# EAGLE design stlink-to-bc (EAGLE 8.0.1)
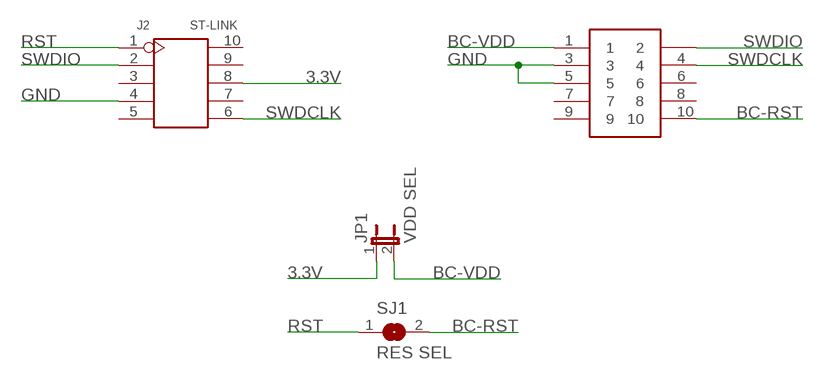
[diagram p0: schematic, sheet 1]

## Parts
J1  BC  SHF105  [SHF105DSM_1]
J2  ST-LINK  DIP-BLACK-FEMALE-HEADER(2X5P-2.54)V2X5-2.54  [V2X5-2.54]
JP1  VDD SEL  JP1E  [JP1]
SJ1  RES SEL  SJ  [SJ]

## Nets
3.3V: J2.8 JP1.1
BC-RST: J1.10 SJ1.2
BC-VDD: J1.1 JP1.2
GND: J1.3 J1.5 J2.4
RST: J2.1 SJ1.1
SWDCLK: J1.4 J2.6
SWDIO: J1.2 J2.2
Unconnected: J1.6 J1.7 J1.8 J1.9 J2.3 J2.5 J2.7 J2.9 J2.10

## Library data of the parts
J1 = Gadgeteer:SHF105
J2 = connector:DIP-BLACK-FEMALE-HEADER(2X5P-2.54): 320030088
JP1 = jumper:JP1E: JUMPER
SJ1 = jumper:SJ: SMD solder JUMPER

## Board
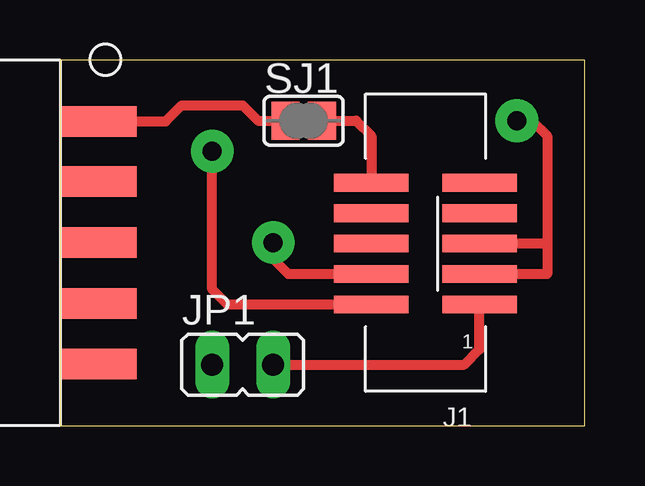
[diagram p1: board, top side]
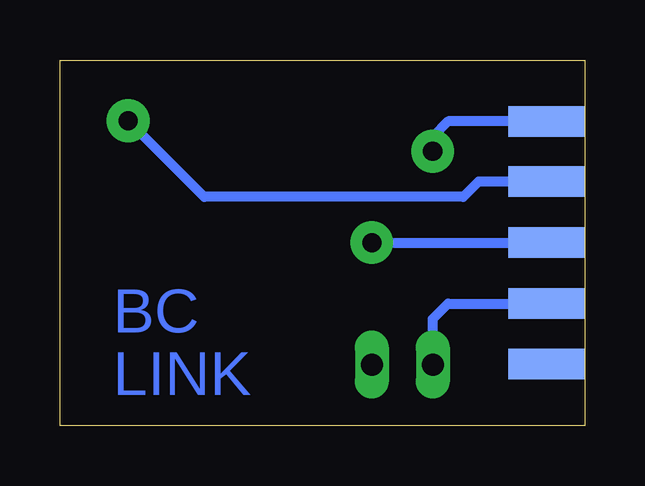
[diagram p2: board, bottom side, seen from below]

Size 21.89 x 15.23 mm. Coordinates in mm from the lower left corner, seen from the top.
Outline: 0,0 21.89,0 21.89,15.23 0,15.23 0,0
Copper layers (1*16): Top 0.035mm / dielectric 1.5mm / Bottom 0.035mm
Design rules "default *": minimum track width 10mil, minimum drill 24mil, track to track 10mil, track to pad 10mil, pad to pad 10mil, via to via 10mil, smd to smd 10mil, copper to edge 1mm, drill to drill 10mil, minimum pad ring 10mil, minimum via ring 8mil, stop-mask expansion 4mil, vias tented up to drill 0mil, thermal gap 10mil

### Footprints (pad centres in the part's own frame; a part is rotated, then mirrored left to right if it is on the bottom)
SHF105DSM_1 = smd 3.108 x 0.74: 1 -2.254,2.58; 2 2.254,2.58; 3 -2.254,1.31; 4 2.254,1.31; 5 -2.254,0.04; 6 2.254,0.04; 7 -2.254,-1.23; 8 2.254,-1.23; 9 -2.254,-2.5; 10 2.254,-2.5
V2X5-2.54 = smd 3.2 x 1.27: 1 1.6,5.05; 3 1.6,2.54; 5 1.6,0; 7 1.6,-2.54; 9 1.6,-5.05 | smd 3.2 x 1.27 bottom: 2 1.6,5.05; 4 1.6,2.54; 6 1.6,0; 8 1.6,-2.54; 10 1.6,-5.05
JP1 = drill 0.914 long: 1 0,-1.27; 2 0,1.27
SJ = smd 1.168 x 1.6: 1 -0.762,0; 2 0.762,0

### Placement (x,y rotation side)
J1  15.24,7.62 180 top
J2  0,7.62 0 top
JP1  7.62,2.54 270 top
SJ1  10.16,12.7 0 top

### Tracks (layer width: path | path; a pad name or v marks a point on that pad's centre or on a via)
3.3V
  Bottom 0.406: JP1.1 6.35,4.45 5.71,5.08 J2.8
BC-RST
  Top 0.406: SJ1.2 12.35,12.7 12.99,12.06 J1.10
BC-VDD
  Top 0.406: JP1.2 16.86,2.54 17.49,3.17 J1.1
GND  (via drill 0.8 pad 1.78)
  Top 0.406: J1.3 20.32,6.31 20.32,7.58 | 20.32,7.58 J1.5 | v19.05,12.7 19.68,12.7 20.32,12.06 20.32,7.58
  Bottom 0.406: J2.4 4.45,10.16 5.08,9.53 15.88,9.53 v19.05,12.7
RST
  Top 0.406: 1.6,12.7 J2.1 4.42,12.67 5.08,13.34 7.62,13.34 8.26,12.7 SJ1.1
SWDCLK  (via drill 0.8 pad 1.78)
  Top 0.406: J1.4 9.53,6.31 8.89,6.95 v8.89,7.62
  Bottom 0.406: v8.89,7.62 J2.6
SWDIO  (via drill 0.8 pad 1.78)
  Top 0.406: J1.2 6.99,5.04 6.35,5.67 v6.35,11.43
  Bottom 0.406: J2.2 5.71,12.67 6.35,12.04 v6.35,11.43

### Text on the board
Bottom: BC / LINK